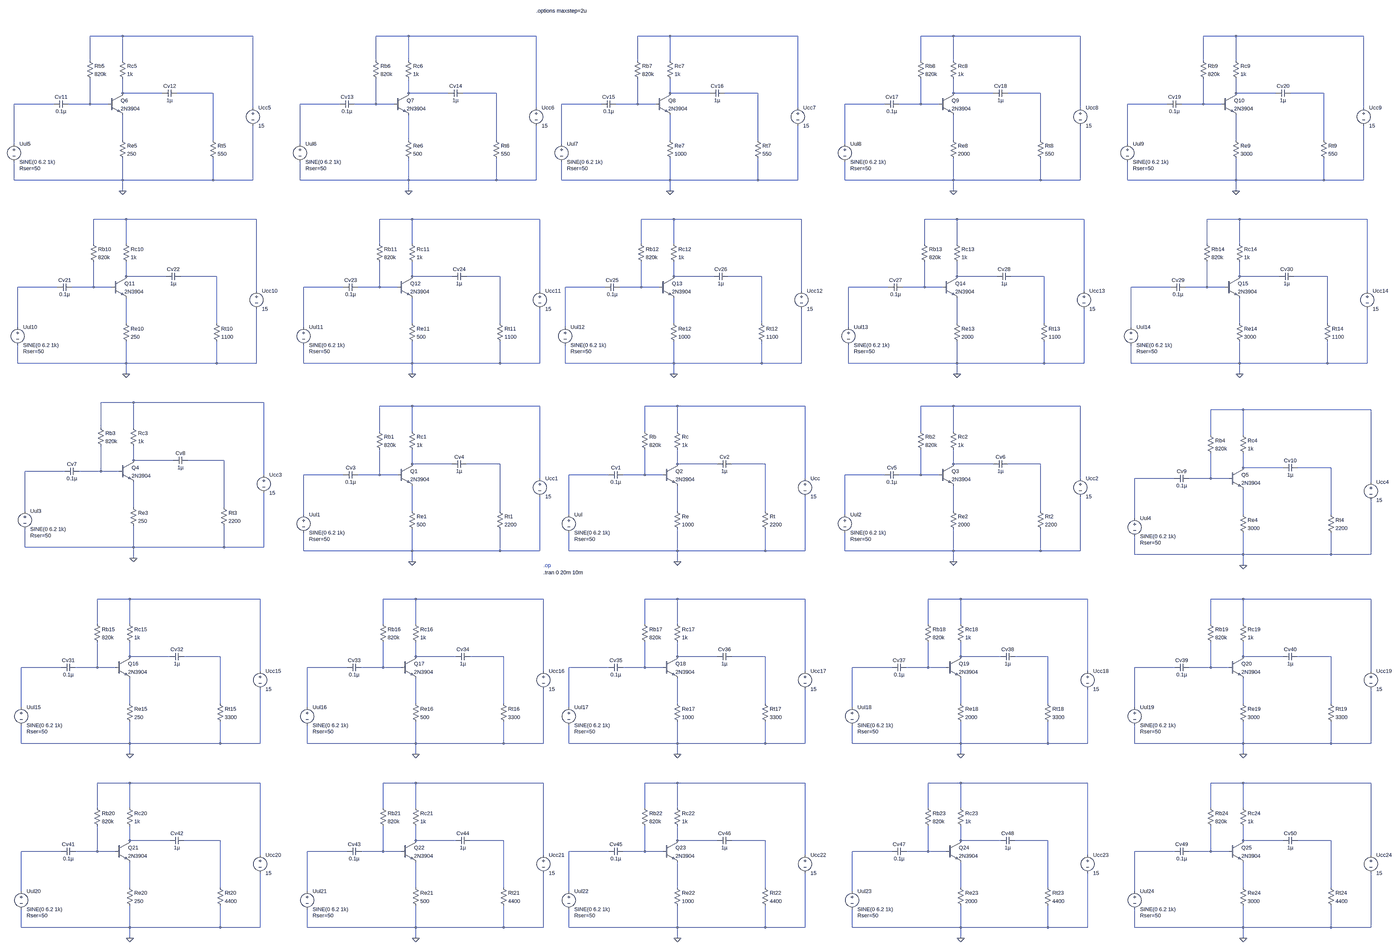
[diagram p0: schematic SPOJ-SZE-SIMULACIJA.asc, whole sheet]
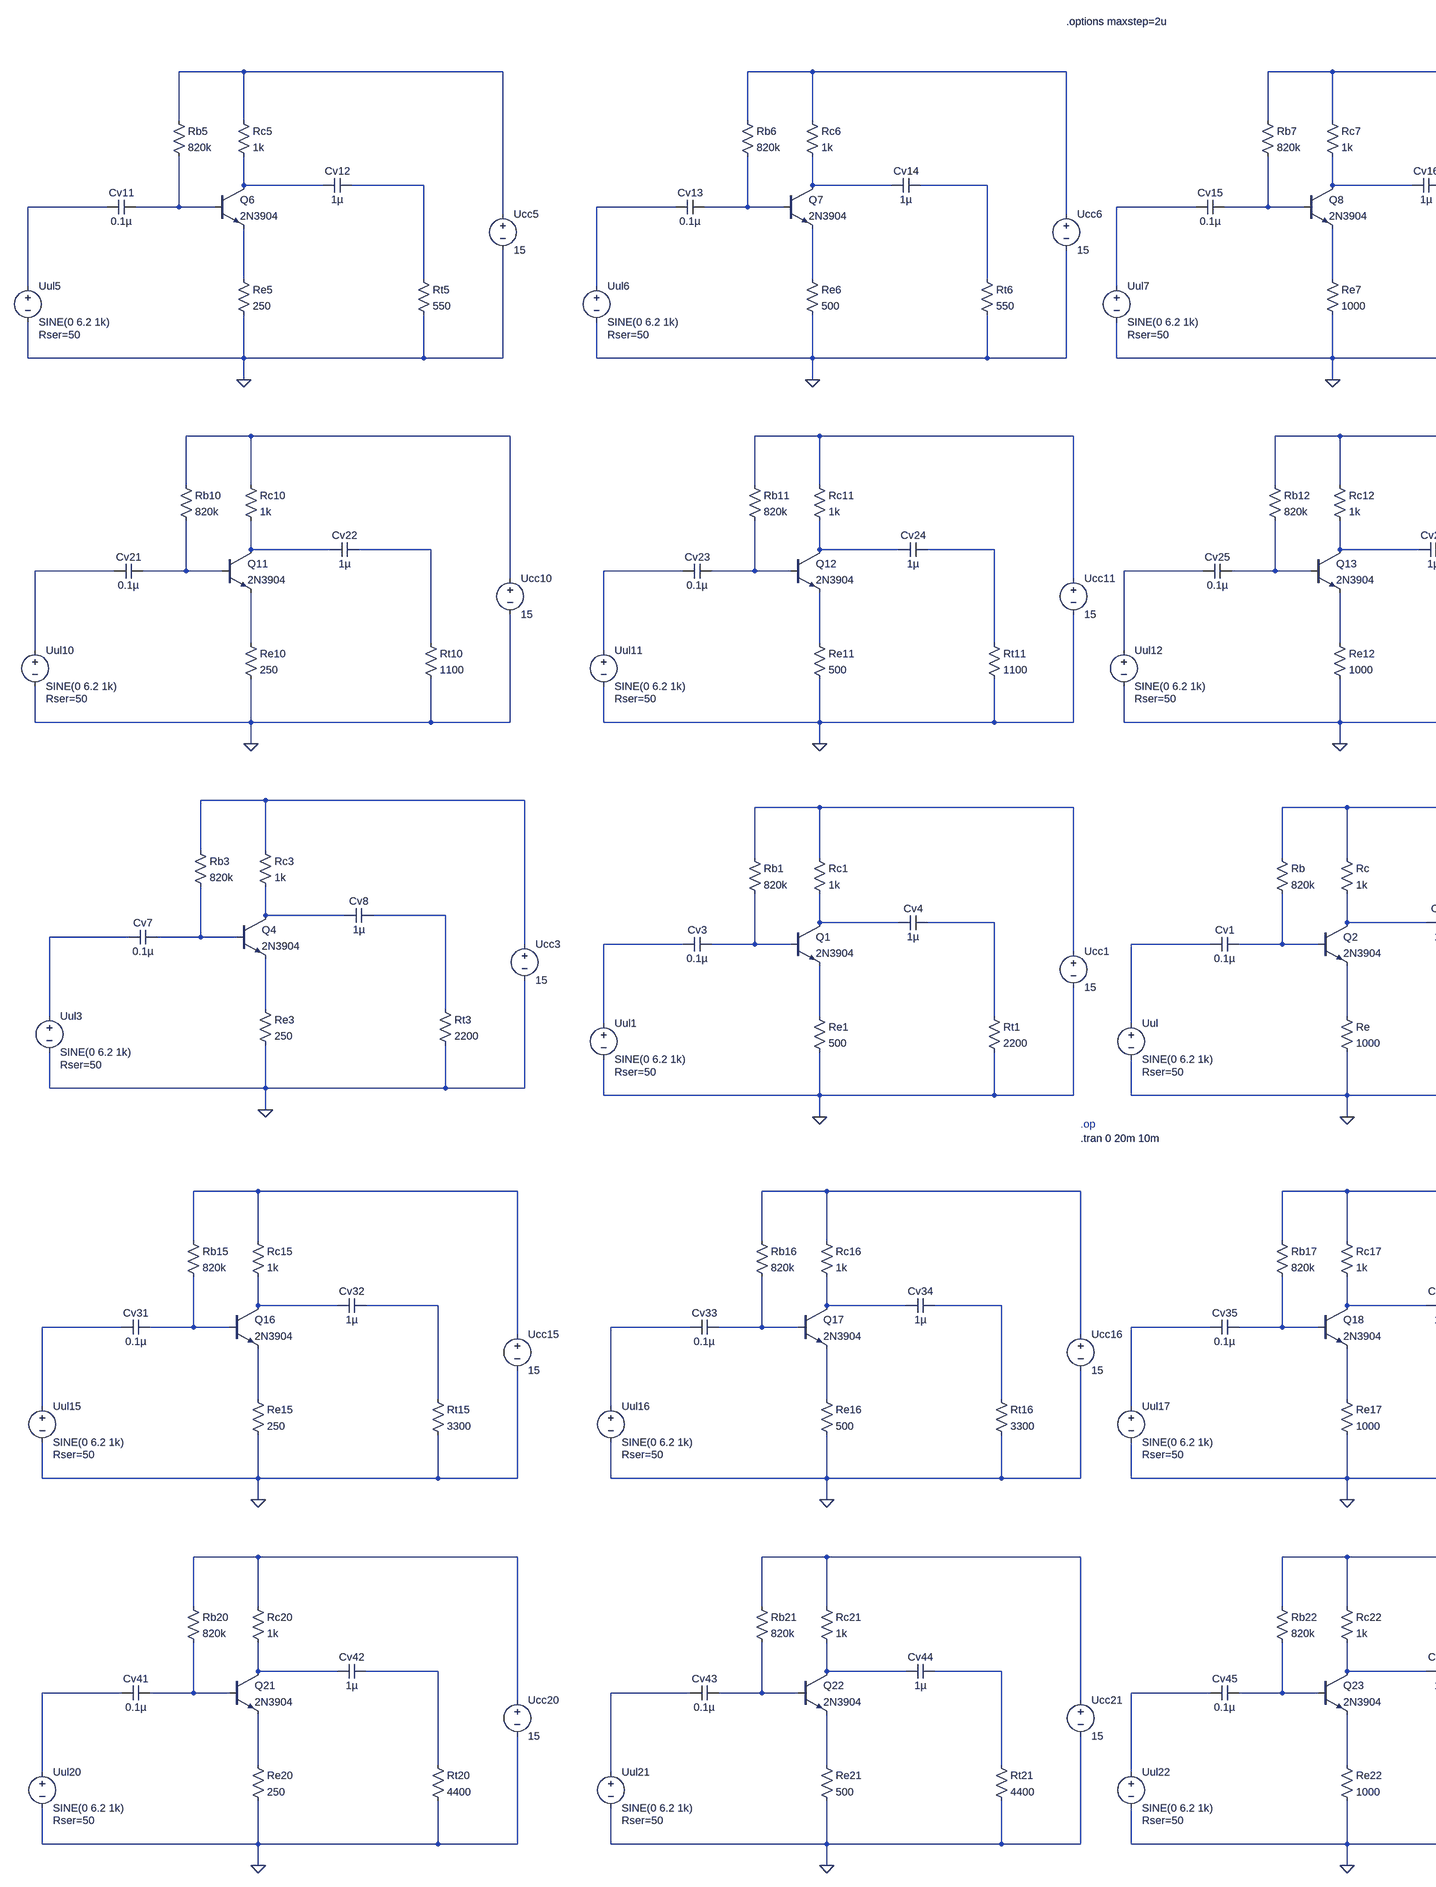
[diagram p1: schematic SPOJ-SZE-SIMULACIJA.asc, part, row 1 of 1, column 1 of 2]
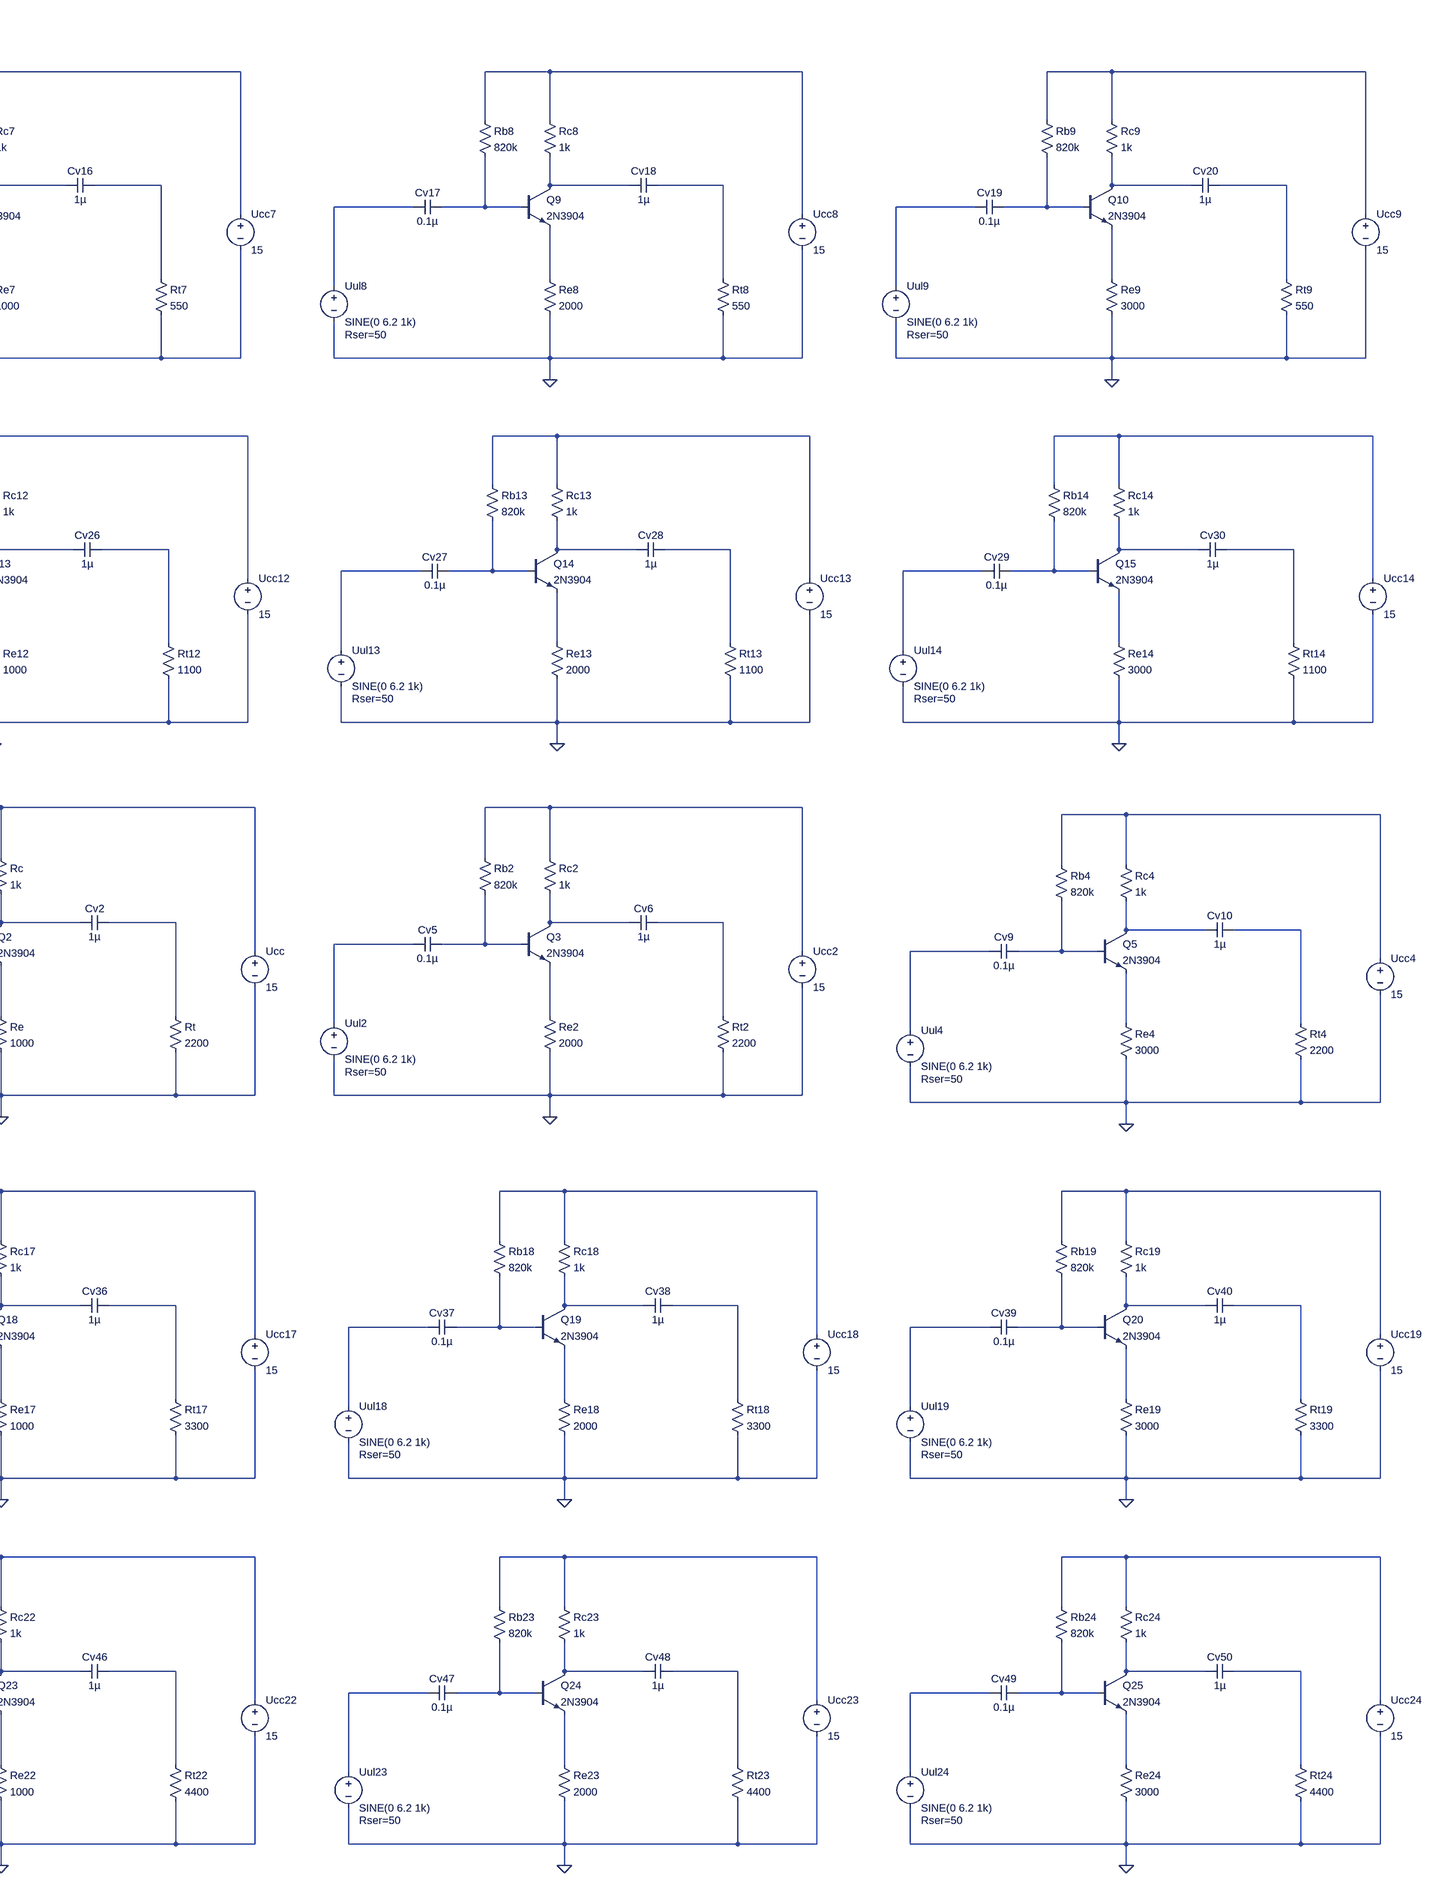
[diagram p2: schematic SPOJ-SZE-SIMULACIJA.asc, part, row 1 of 1, column 2 of 2]
SPOJ-SZE-SIMULACIJA.asc, the LTspice schematic file:
Version 4.1
SHEET 1 4308 3988
WIRE -1392 -464 -1536 -464
WIRE -816 -464 -1392 -464
WIRE -128 -464 -272 -464
WIRE 448 -464 -128 -464
WIRE 1040 -464 896 -464
WIRE 1616 -464 1040 -464
WIRE 2304 -464 2160 -464
WIRE 2880 -464 2304 -464
WIRE 3568 -464 3424 -464
WIRE 4144 -464 3568 -464
WIRE -1536 -352 -1536 -464
WIRE -1392 -352 -1392 -464
WIRE -272 -352 -272 -464
WIRE -128 -352 -128 -464
WIRE 896 -352 896 -464
WIRE 1040 -352 1040 -464
WIRE 2160 -352 2160 -464
WIRE 2304 -352 2304 -464
WIRE 3424 -352 3424 -464
WIRE 3568 -352 3568 -464
WIRE -1392 -208 -1392 -272
WIRE -1216 -208 -1392 -208
WIRE -992 -208 -1152 -208
WIRE -128 -208 -128 -272
WIRE 48 -208 -128 -208
WIRE 272 -208 112 -208
WIRE 1040 -208 1040 -272
WIRE 1216 -208 1040 -208
WIRE 1440 -208 1280 -208
WIRE 2304 -208 2304 -272
WIRE 2480 -208 2304 -208
WIRE 2704 -208 2544 -208
WIRE 3568 -208 3568 -272
WIRE 3744 -208 3568 -208
WIRE 3968 -208 3808 -208
WIRE -1696 -160 -1872 -160
WIRE -1536 -160 -1536 -272
WIRE -1536 -160 -1632 -160
WIRE -1456 -160 -1536 -160
WIRE -432 -160 -608 -160
WIRE -272 -160 -272 -272
WIRE -272 -160 -368 -160
WIRE -192 -160 -272 -160
WIRE 736 -160 560 -160
WIRE 896 -160 896 -272
WIRE 896 -160 800 -160
WIRE 976 -160 896 -160
WIRE 2000 -160 1824 -160
WIRE 2160 -160 2160 -272
WIRE 2160 -160 2064 -160
WIRE 2240 -160 2160 -160
WIRE 3264 -160 3088 -160
WIRE 3424 -160 3424 -272
WIRE 3424 -160 3328 -160
WIRE 3504 -160 3424 -160
WIRE -816 -144 -816 -464
WIRE 448 -144 448 -464
WIRE 1616 -144 1616 -464
WIRE 2880 -144 2880 -464
WIRE 4144 -144 4144 -464
WIRE -1392 0 -1392 -112
WIRE -992 0 -992 -208
WIRE -128 0 -128 -112
WIRE 272 0 272 -208
WIRE 1040 0 1040 -112
WIRE 1440 0 1440 -208
WIRE 2304 0 2304 -112
WIRE 2704 0 2704 -208
WIRE 3568 0 3568 -112
WIRE 3968 0 3968 -208
WIRE -1872 16 -1872 -160
WIRE -608 16 -608 -160
WIRE 560 16 560 -160
WIRE 1824 16 1824 -160
WIRE 3088 16 3088 -160
WIRE -1872 176 -1872 96
WIRE -1392 176 -1392 80
WIRE -1392 176 -1872 176
WIRE -992 176 -992 80
WIRE -992 176 -1392 176
WIRE -816 176 -816 -64
WIRE -816 176 -992 176
WIRE -608 176 -608 96
WIRE -128 176 -128 80
WIRE -128 176 -608 176
WIRE 272 176 272 80
WIRE 272 176 -128 176
WIRE 448 176 448 -64
WIRE 448 176 272 176
WIRE 560 176 560 96
WIRE 1040 176 1040 80
WIRE 1040 176 560 176
WIRE 1440 176 1440 80
WIRE 1440 176 1040 176
WIRE 1616 176 1616 -64
WIRE 1616 176 1440 176
WIRE 1824 176 1824 96
WIRE 2304 176 2304 80
WIRE 2304 176 1824 176
WIRE 2704 176 2704 80
WIRE 2704 176 2304 176
WIRE 2880 176 2880 -64
WIRE 2880 176 2704 176
WIRE 3088 176 3088 96
WIRE 3568 176 3568 80
WIRE 3568 176 3088 176
WIRE 3968 176 3968 80
WIRE 3968 176 3568 176
WIRE 4144 176 4144 -64
WIRE 4144 176 3968 176
WIRE -1392 224 -1392 176
WIRE -128 224 -128 176
WIRE 1040 224 1040 176
WIRE 2304 224 2304 176
WIRE 3568 224 3568 176
WIRE -1376 464 -1520 464
WIRE -800 464 -1376 464
WIRE -112 464 -256 464
WIRE 464 464 -112 464
WIRE 1056 464 912 464
WIRE 1632 464 1056 464
WIRE 2320 464 2176 464
WIRE 2896 464 2320 464
WIRE 3584 464 3440 464
WIRE 4160 464 3584 464
WIRE -1520 576 -1520 464
WIRE -1376 576 -1376 464
WIRE -256 576 -256 464
WIRE -112 576 -112 464
WIRE 912 576 912 464
WIRE 1056 576 1056 464
WIRE 2176 576 2176 464
WIRE 2320 576 2320 464
WIRE 3440 576 3440 464
WIRE 3584 576 3584 464
WIRE -1376 720 -1376 656
WIRE -1200 720 -1376 720
WIRE -976 720 -1136 720
WIRE -112 720 -112 656
WIRE 64 720 -112 720
WIRE 288 720 128 720
WIRE 1056 720 1056 656
WIRE 1232 720 1056 720
WIRE 1456 720 1296 720
WIRE 2320 720 2320 656
WIRE 2496 720 2320 720
WIRE 2720 720 2560 720
WIRE 3584 720 3584 656
WIRE 3760 720 3584 720
WIRE 3984 720 3824 720
WIRE -1680 768 -1856 768
WIRE -1520 768 -1520 656
WIRE -1520 768 -1616 768
WIRE -1440 768 -1520 768
WIRE -416 768 -592 768
WIRE -256 768 -256 656
WIRE -256 768 -352 768
WIRE -176 768 -256 768
WIRE 752 768 576 768
WIRE 912 768 912 656
WIRE 912 768 816 768
WIRE 992 768 912 768
WIRE 2016 768 1840 768
WIRE 2176 768 2176 656
WIRE 2176 768 2080 768
WIRE 2256 768 2176 768
WIRE 3280 768 3104 768
WIRE 3440 768 3440 656
WIRE 3440 768 3344 768
WIRE 3520 768 3440 768
WIRE -800 784 -800 464
WIRE 464 784 464 464
WIRE 1632 784 1632 464
WIRE 2896 784 2896 464
WIRE 4160 784 4160 464
WIRE -1376 928 -1376 816
WIRE -976 928 -976 720
WIRE -112 928 -112 816
WIRE 288 928 288 720
WIRE 1056 928 1056 816
WIRE 1456 928 1456 720
WIRE 2320 928 2320 816
WIRE 2720 928 2720 720
WIRE 3584 928 3584 816
WIRE 3984 928 3984 720
WIRE -1856 944 -1856 768
WIRE -592 944 -592 768
WIRE 576 944 576 768
WIRE 1840 944 1840 768
WIRE 3104 944 3104 768
WIRE -1856 1104 -1856 1024
WIRE -1376 1104 -1376 1008
WIRE -1376 1104 -1856 1104
WIRE -976 1104 -976 1008
WIRE -976 1104 -1376 1104
WIRE -800 1104 -800 864
WIRE -800 1104 -976 1104
WIRE -592 1104 -592 1024
WIRE -112 1104 -112 1008
WIRE -112 1104 -592 1104
WIRE 288 1104 288 1008
WIRE 288 1104 -112 1104
WIRE 464 1104 464 864
WIRE 464 1104 288 1104
WIRE 576 1104 576 1024
WIRE 1056 1104 1056 1008
WIRE 1056 1104 576 1104
WIRE 1456 1104 1456 1008
WIRE 1456 1104 1056 1104
WIRE 1632 1104 1632 864
WIRE 1632 1104 1456 1104
WIRE 1840 1104 1840 1024
WIRE 2320 1104 2320 1008
WIRE 2320 1104 1840 1104
WIRE 2720 1104 2720 1008
WIRE 2720 1104 2320 1104
WIRE 2896 1104 2896 864
WIRE 2896 1104 2720 1104
WIRE 3104 1104 3104 1024
WIRE 3584 1104 3584 1008
WIRE 3584 1104 3104 1104
WIRE 3984 1104 3984 1008
WIRE 3984 1104 3584 1104
WIRE 4160 1104 4160 864
WIRE 4160 1104 3984 1104
WIRE -1376 1152 -1376 1104
WIRE -112 1152 -112 1104
WIRE 1056 1152 1056 1104
WIRE 2320 1152 2320 1104
WIRE 3584 1152 3584 1104
WIRE -1344 1296 -1488 1296
WIRE -768 1296 -1344 1296
WIRE -112 1312 -256 1312
WIRE 464 1312 -112 1312
WIRE 1072 1312 928 1312
WIRE 1648 1312 1072 1312
WIRE 2304 1312 2160 1312
WIRE 2880 1312 2304 1312
WIRE 3600 1328 3456 1328
WIRE 4176 1328 3600 1328
WIRE -1488 1408 -1488 1296
WIRE -1344 1408 -1344 1296
WIRE -256 1424 -256 1312
WIRE -112 1424 -112 1312
WIRE 928 1424 928 1312
WIRE 1072 1424 1072 1312
WIRE 2160 1424 2160 1312
WIRE 2304 1424 2304 1312
WIRE 3456 1440 3456 1328
WIRE 3600 1440 3600 1328
WIRE -1344 1552 -1344 1488
WIRE -1168 1552 -1344 1552
WIRE -944 1552 -1104 1552
WIRE -112 1568 -112 1504
WIRE 64 1568 -112 1568
WIRE 288 1568 128 1568
WIRE 1072 1568 1072 1504
WIRE 1248 1568 1072 1568
WIRE 1472 1568 1312 1568
WIRE 2304 1568 2304 1504
WIRE 2480 1568 2304 1568
WIRE 2704 1568 2544 1568
WIRE 3600 1584 3600 1520
WIRE 3776 1584 3600 1584
WIRE 4000 1584 3840 1584
WIRE -1648 1600 -1824 1600
WIRE -1488 1600 -1488 1488
WIRE -1488 1600 -1584 1600
WIRE -1408 1600 -1488 1600
WIRE -768 1616 -768 1296
WIRE -416 1616 -592 1616
WIRE -256 1616 -256 1504
WIRE -256 1616 -352 1616
WIRE -176 1616 -256 1616
WIRE 768 1616 592 1616
WIRE 928 1616 928 1504
WIRE 928 1616 832 1616
WIRE 1008 1616 928 1616
WIRE 2000 1616 1824 1616
WIRE 2160 1616 2160 1504
WIRE 2160 1616 2064 1616
WIRE 2240 1616 2160 1616
WIRE 464 1632 464 1312
WIRE 1648 1632 1648 1312
WIRE 2880 1632 2880 1312
WIRE 3296 1632 3120 1632
WIRE 3456 1632 3456 1520
WIRE 3456 1632 3360 1632
WIRE 3536 1632 3456 1632
WIRE 4176 1648 4176 1328
WIRE -1344 1760 -1344 1648
WIRE -944 1760 -944 1552
WIRE -1824 1776 -1824 1600
WIRE -112 1776 -112 1664
WIRE 288 1776 288 1568
WIRE 1072 1776 1072 1664
WIRE 1472 1776 1472 1568
WIRE 2304 1776 2304 1664
WIRE 2704 1776 2704 1568
WIRE -592 1792 -592 1616
WIRE 592 1792 592 1616
WIRE 1824 1792 1824 1616
WIRE 3600 1792 3600 1680
WIRE 4000 1792 4000 1584
WIRE 3120 1808 3120 1632
WIRE -1824 1936 -1824 1856
WIRE -1344 1936 -1344 1840
WIRE -1344 1936 -1824 1936
WIRE -944 1936 -944 1840
WIRE -944 1936 -1344 1936
WIRE -768 1936 -768 1696
WIRE -768 1936 -944 1936
WIRE -592 1952 -592 1872
WIRE -112 1952 -112 1856
WIRE -112 1952 -592 1952
WIRE 288 1952 288 1856
WIRE 288 1952 -112 1952
WIRE 464 1952 464 1712
WIRE 464 1952 288 1952
WIRE 592 1952 592 1872
WIRE 1072 1952 1072 1856
WIRE 1072 1952 592 1952
WIRE 1472 1952 1472 1856
WIRE 1472 1952 1072 1952
WIRE 1648 1952 1648 1712
WIRE 1648 1952 1472 1952
WIRE 1824 1952 1824 1872
WIRE 2304 1952 2304 1856
WIRE 2304 1952 1824 1952
WIRE 2704 1952 2704 1856
WIRE 2704 1952 2304 1952
WIRE 2880 1952 2880 1712
WIRE 2880 1952 2704 1952
WIRE 3120 1968 3120 1888
WIRE 3600 1968 3600 1872
WIRE 3600 1968 3120 1968
WIRE 4000 1968 4000 1872
WIRE 4000 1968 3600 1968
WIRE 4176 1968 4176 1728
WIRE 4176 1968 4000 1968
WIRE -1344 1984 -1344 1936
WIRE -112 2000 -112 1952
WIRE 1072 2000 1072 1952
WIRE 2304 2000 2304 1952
WIRE 3600 2016 3600 1968
WIRE -1360 2320 -1504 2320
WIRE -784 2320 -1360 2320
WIRE -96 2320 -240 2320
WIRE 480 2320 -96 2320
WIRE 1072 2320 928 2320
WIRE 1648 2320 1072 2320
WIRE 2336 2320 2192 2320
WIRE 2912 2320 2336 2320
WIRE 3600 2320 3456 2320
WIRE 4176 2320 3600 2320
WIRE -1504 2432 -1504 2320
WIRE -1360 2432 -1360 2320
WIRE -240 2432 -240 2320
WIRE -96 2432 -96 2320
WIRE 928 2432 928 2320
WIRE 1072 2432 1072 2320
WIRE 2192 2432 2192 2320
WIRE 2336 2432 2336 2320
WIRE 3456 2432 3456 2320
WIRE 3600 2432 3600 2320
WIRE -1360 2576 -1360 2512
WIRE -1184 2576 -1360 2576
WIRE -960 2576 -1120 2576
WIRE -96 2576 -96 2512
WIRE 80 2576 -96 2576
WIRE 304 2576 144 2576
WIRE 1072 2576 1072 2512
WIRE 1248 2576 1072 2576
WIRE 1472 2576 1312 2576
WIRE 2336 2576 2336 2512
WIRE 2512 2576 2336 2576
WIRE 2736 2576 2576 2576
WIRE 3600 2576 3600 2512
WIRE 3776 2576 3600 2576
WIRE 4000 2576 3840 2576
WIRE -1664 2624 -1840 2624
WIRE -1504 2624 -1504 2512
WIRE -1504 2624 -1600 2624
WIRE -1424 2624 -1504 2624
WIRE -400 2624 -576 2624
WIRE -240 2624 -240 2512
WIRE -240 2624 -336 2624
WIRE -160 2624 -240 2624
WIRE 768 2624 592 2624
WIRE 928 2624 928 2512
WIRE 928 2624 832 2624
WIRE 1008 2624 928 2624
WIRE 2032 2624 1856 2624
WIRE 2192 2624 2192 2512
WIRE 2192 2624 2096 2624
WIRE 2272 2624 2192 2624
WIRE 3296 2624 3120 2624
WIRE 3456 2624 3456 2512
WIRE 3456 2624 3360 2624
WIRE 3536 2624 3456 2624
WIRE -784 2640 -784 2320
WIRE 480 2640 480 2320
WIRE 1648 2640 1648 2320
WIRE 2912 2640 2912 2320
WIRE 4176 2640 4176 2320
WIRE -1360 2784 -1360 2672
WIRE -960 2784 -960 2576
WIRE -96 2784 -96 2672
WIRE 304 2784 304 2576
WIRE 1072 2784 1072 2672
WIRE 1472 2784 1472 2576
WIRE 2336 2784 2336 2672
WIRE 2736 2784 2736 2576
WIRE 3600 2784 3600 2672
WIRE 4000 2784 4000 2576
WIRE -1840 2800 -1840 2624
WIRE -576 2800 -576 2624
WIRE 592 2800 592 2624
WIRE 1856 2800 1856 2624
WIRE 3120 2800 3120 2624
WIRE -1840 2960 -1840 2880
WIRE -1360 2960 -1360 2864
WIRE -1360 2960 -1840 2960
WIRE -960 2960 -960 2864
WIRE -960 2960 -1360 2960
WIRE -784 2960 -784 2720
WIRE -784 2960 -960 2960
WIRE -576 2960 -576 2880
WIRE -96 2960 -96 2864
WIRE -96 2960 -576 2960
WIRE 304 2960 304 2864
WIRE 304 2960 -96 2960
WIRE 480 2960 480 2720
WIRE 480 2960 304 2960
WIRE 592 2960 592 2880
WIRE 1072 2960 1072 2864
WIRE 1072 2960 592 2960
WIRE 1472 2960 1472 2864
WIRE 1472 2960 1072 2960
WIRE 1648 2960 1648 2720
WIRE 1648 2960 1472 2960
WIRE 1856 2960 1856 2880
WIRE 2336 2960 2336 2864
WIRE 2336 2960 1856 2960
WIRE 2736 2960 2736 2864
WIRE 2736 2960 2336 2960
WIRE 2912 2960 2912 2720
WIRE 2912 2960 2736 2960
WIRE 3120 2960 3120 2880
WIRE 3600 2960 3600 2864
WIRE 3600 2960 3120 2960
WIRE 4000 2960 4000 2864
WIRE 4000 2960 3600 2960
WIRE 4176 2960 4176 2720
WIRE 4176 2960 4000 2960
WIRE -1360 3008 -1360 2960
WIRE -96 3008 -96 2960
WIRE 1072 3008 1072 2960
WIRE 2336 3008 2336 2960
WIRE 3600 3008 3600 2960
WIRE -1360 3280 -1504 3280
WIRE -784 3280 -1360 3280
WIRE -96 3280 -240 3280
WIRE 480 3280 -96 3280
WIRE 1072 3280 928 3280
WIRE 1648 3280 1072 3280
WIRE 2336 3280 2192 3280
WIRE 2912 3280 2336 3280
WIRE 3600 3280 3456 3280
WIRE 4176 3280 3600 3280
WIRE -1504 3392 -1504 3280
WIRE -1360 3392 -1360 3280
WIRE -240 3392 -240 3280
WIRE -96 3392 -96 3280
WIRE 928 3392 928 3280
WIRE 1072 3392 1072 3280
WIRE 2192 3392 2192 3280
WIRE 2336 3392 2336 3280
WIRE 3456 3392 3456 3280
WIRE 3600 3392 3600 3280
WIRE -1360 3536 -1360 3472
WIRE -1184 3536 -1360 3536
WIRE -960 3536 -1120 3536
WIRE -96 3536 -96 3472
WIRE 80 3536 -96 3536
WIRE 304 3536 144 3536
WIRE 1072 3536 1072 3472
WIRE 1248 3536 1072 3536
WIRE 1472 3536 1312 3536
WIRE 2336 3536 2336 3472
WIRE 2512 3536 2336 3536
WIRE 2736 3536 2576 3536
WIRE 3600 3536 3600 3472
WIRE 3776 3536 3600 3536
WIRE 4000 3536 3840 3536
WIRE -1664 3584 -1840 3584
WIRE -1504 3584 -1504 3472
WIRE -1504 3584 -1600 3584
WIRE -1424 3584 -1504 3584
WIRE -400 3584 -576 3584
WIRE -240 3584 -240 3472
WIRE -240 3584 -336 3584
WIRE -160 3584 -240 3584
WIRE 768 3584 592 3584
WIRE 928 3584 928 3472
WIRE 928 3584 832 3584
WIRE 1008 3584 928 3584
WIRE 2032 3584 1856 3584
WIRE 2192 3584 2192 3472
WIRE 2192 3584 2096 3584
WIRE 2272 3584 2192 3584
WIRE 3296 3584 3120 3584
WIRE 3456 3584 3456 3472
WIRE 3456 3584 3360 3584
WIRE 3536 3584 3456 3584
WIRE -784 3600 -784 3280
WIRE 480 3600 480 3280
WIRE 1648 3600 1648 3280
WIRE 2912 3600 2912 3280
WIRE 4176 3600 4176 3280
WIRE -1360 3744 -1360 3632
WIRE -960 3744 -960 3536
WIRE -96 3744 -96 3632
WIRE 304 3744 304 3536
WIRE 1072 3744 1072 3632
WIRE 1472 3744 1472 3536
WIRE 2336 3744 2336 3632
WIRE 2736 3744 2736 3536
WIRE 3600 3744 3600 3632
WIRE 4000 3744 4000 3536
WIRE -1840 3760 -1840 3584
WIRE -576 3760 -576 3584
WIRE 592 3760 592 3584
WIRE 1856 3760 1856 3584
WIRE 3120 3760 3120 3584
WIRE -1840 3920 -1840 3840
WIRE -1360 3920 -1360 3824
WIRE -1360 3920 -1840 3920
WIRE -960 3920 -960 3824
WIRE -960 3920 -1360 3920
WIRE -784 3920 -784 3680
WIRE -784 3920 -960 3920
WIRE -576 3920 -576 3840
WIRE -96 3920 -96 3824
WIRE -96 3920 -576 3920
WIRE 304 3920 304 3824
WIRE 304 3920 -96 3920
WIRE 480 3920 480 3680
WIRE 480 3920 304 3920
WIRE 592 3920 592 3840
WIRE 1072 3920 1072 3824
WIRE 1072 3920 592 3920
WIRE 1472 3920 1472 3824
WIRE 1472 3920 1072 3920
WIRE 1648 3920 1648 3680
WIRE 1648 3920 1472 3920
WIRE 1856 3920 1856 3840
WIRE 2336 3920 2336 3824
WIRE 2336 3920 1856 3920
WIRE 2736 3920 2736 3824
WIRE 2736 3920 2336 3920
WIRE 2912 3920 2912 3680
WIRE 2912 3920 2736 3920
WIRE 3120 3920 3120 3840
WIRE 3600 3920 3600 3824
WIRE 3600 3920 3120 3920
WIRE 4000 3920 4000 3824
WIRE 4000 3920 3600 3920
WIRE 4176 3920 4176 3680
WIRE 4176 3920 4000 3920
WIRE -1360 3968 -1360 3920
WIRE -96 3968 -96 3920
WIRE 1072 3968 1072 3920
WIRE 2336 3968 2336 3920
WIRE 3600 3968 3600 3920
FLAG 1072 2000 0
FLAG -112 2000 0
FLAG 2304 2000 0
FLAG -1344 1984 0
FLAG 3600 2016 0
FLAG -1392 224 0
FLAG -128 224 0
FLAG 1040 224 0
FLAG 2304 224 0
FLAG 3568 224 0
FLAG -1376 1152 0
FLAG -112 1152 0
FLAG 1056 1152 0
FLAG 2320 1152 0
FLAG 3584 1152 0
FLAG -1360 3008 0
FLAG -96 3008 0
FLAG 1072 3008 0
FLAG 2336 3008 0
FLAG 3600 3008 0
FLAG -1360 3968 0
FLAG -96 3968 0
FLAG 1072 3968 0
FLAG 2336 3968 0
FLAG 3600 3968 0
SYMBOL npn 1008 1568 R0
SYMATTR InstName Q2
SYMATTR Value 2N3904
SYMBOL cap 832 1600 R90
WINDOW 0 0 32 VBottom 2
WINDOW 3 32 32 VTop 2
SYMATTR InstName Cv1
SYMATTR Value 0.1µ
SYMBOL cap 1312 1552 R90
WINDOW 0 0 32 VBottom 2
WINDOW 3 32 32 VTop 2
SYMATTR InstName Cv2
SYMATTR Value 1µ
SYMBOL res 1056 1760 R0
SYMATTR InstName Re
SYMATTR Value 1000
SYMBOL res 1456 1760 R0
SYMATTR InstName Rt
SYMATTR Value 2200
SYMBOL voltage 592 1776 R0
WINDOW 123 0 0 Left 0
WINDOW 39 24 124 Left 2
SYMATTR SpiceLine Rser=50
SYMATTR InstName Uul
SYMATTR Value SINE(0 6.2 1k)
SYMBOL voltage 1648 1616 R0
WINDOW 123 0 0 Left 0
WINDOW 39 0 0 Left 0
SYMATTR InstName Ucc
SYMATTR Value 15
SYMBOL res 1056 1408 R0
SYMATTR InstName Rc
SYMATTR Value 1k
SYMBOL res 912 1408 R0
SYMATTR InstName Rb
SYMATTR Value 820k
SYMBOL npn -176 1568 R0
SYMATTR InstName Q1
SYMATTR Value 2N3904
SYMBOL cap -352 1600 R90
WINDOW 0 0 32 VBottom 2
WINDOW 3 32 32 VTop 2
SYMATTR InstName Cv3
SYMATTR Value 0.1µ
SYMBOL cap 128 1552 R90
WINDOW 0 0 32 VBottom 2
WINDOW 3 32 32 VTop 2
SYMATTR InstName Cv4
SYMATTR Value 1µ
SYMBOL res -128 1760 R0
SYMATTR InstName Re1
SYMATTR Value 500
SYMBOL res 272 1760 R0
SYMATTR InstName Rt1
SYMATTR Value 2200
SYMBOL voltage -592 1776 R0
WINDOW 123 0 0 Left 0
WINDOW 39 24 124 Left 2
SYMATTR SpiceLine Rser=50
SYMATTR InstName Uul1
SYMATTR Value SINE(0 6.2 1k)
SYMBOL voltage 464 1616 R0
WINDOW 123 0 0 Left 0
WINDOW 39 0 0 Left 0
SYMATTR InstName Ucc1
SYMATTR Value 15
SYMBOL res -128 1408 R0
SYMATTR InstName Rc1
SYMATTR Value 1k
SYMBOL res -272 1408 R0
SYMATTR InstName Rb1
SYMATTR Value 820k
SYMBOL npn 2240 1568 R0
SYMATTR InstName Q3
SYMATTR Value 2N3904
SYMBOL cap 2064 1600 R90
WINDOW 0 0 32 VBottom 2
WINDOW 3 32 32 VTop 2
SYMATTR InstName Cv5
SYMATTR Value 0.1µ
SYMBOL cap 2544 1552 R90
WINDOW 0 0 32 VBottom 2
WINDOW 3 32 32 VTop 2
SYMATTR InstName Cv6
SYMATTR Value 1µ
SYMBOL res 2288 1760 R0
SYMATTR InstName Re2
SYMATTR Value 2000
SYMBOL res 2688 1760 R0
SYMATTR InstName Rt2
SYMATTR Value 2200
SYMBOL voltage 1824 1776 R0
WINDOW 123 0 0 Left 0
WINDOW 39 24 124 Left 2
SYMATTR SpiceLine Rser=50
SYMATTR InstName Uul2
SYMATTR Value SINE(0 6.2 1k)
SYMBOL voltage 2880 1616 R0
WINDOW 123 0 0 Left 0
WINDOW 39 0 0 Left 0
SYMATTR InstName Ucc2
SYMATTR Value 15
SYMBOL res 2288 1408 R0
SYMATTR InstName Rc2
SYMATTR Value 1k
SYMBOL res 2144 1408 R0
SYMATTR InstName Rb2
SYMATTR Value 820k
SYMBOL npn -1408 1552 R0
SYMATTR InstName Q4
SYMATTR Value 2N3904
SYMBOL cap -1584 1584 R90
WINDOW 0 0 32 VBottom 2
WINDOW 3 32 32 VTop 2
SYMATTR InstName Cv7
SYMATTR Value 0.1µ
SYMBOL cap -1104 1536 R90
WINDOW 0 0 32 VBottom 2
WINDOW 3 32 32 VTop 2
SYMATTR InstName Cv8
SYMATTR Value 1µ
SYMBOL res -1360 1744 R0
SYMATTR InstName Re3
SYMATTR Value 250
SYMBOL res -960 1744 R0
SYMATTR InstName Rt3
SYMATTR Value 2200
SYMBOL voltage -1824 1760 R0
WINDOW 123 0 0 Left 0
WINDOW 39 24 124 Left 2
SYMATTR SpiceLine Rser=50
SYMATTR InstName Uul3
SYMATTR Value SINE(0 6.2 1k)
SYMBOL voltage -768 1600 R0
WINDOW 123 0 0 Left 0
WINDOW 39 0 0 Left 0
SYMATTR InstName Ucc3
SYMATTR Value 15
SYMBOL res -1360 1392 R0
SYMATTR InstName Rc3
SYMATTR Value 1k
SYMBOL res -1504 1392 R0
SYMATTR InstName Rb3
SYMATTR Value 820k
SYMBOL npn 3536 1584 R0
SYMATTR InstName Q5
SYMATTR Value 2N3904
SYMBOL cap 3360 1616 R90
WINDOW 0 0 32 VBottom 2
WINDOW 3 32 32 VTop 2
SYMATTR InstName Cv9
SYMATTR Value 0.1µ
SYMBOL cap 3840 1568 R90
WINDOW 0 0 32 VBottom 2
WINDOW 3 32 32 VTop 2
SYMATTR InstName Cv10
SYMATTR Value 1µ
SYMBOL res 3584 1776 R0
SYMATTR InstName Re4
SYMATTR Value 3000
SYMBOL res 3984 1776 R0
SYMATTR InstName Rt4
SYMATTR Value 2200
SYMBOL voltage 3120 1792 R0
WINDOW 123 0 0 Left 0
WINDOW 39 24 124 Left 2
SYMATTR SpiceLine Rser=50
SYMATTR InstName Uul4
SYMATTR Value SINE(0 6.2 1k)
SYMBOL voltage 4176 1632 R0
WINDOW 123 0 0 Left 0
WINDOW 39 0 0 Left 0
SYMATTR InstName Ucc4
SYMATTR Value 15
SYMBOL res 3584 1424 R0
SYMATTR InstName Rc4
SYMATTR Value 1k
SYMBOL res 3440 1424 R0
SYMATTR InstName Rb4
SYMATTR Value 820k
SYMBOL npn -1456 -208 R0
SYMATTR InstName Q6
SYMATTR Value 2N3904
SYMBOL cap -1632 -176 R90
WINDOW 0 0 32 VBottom 2
WINDOW 3 32 32 VTop 2
SYMATTR InstName Cv11
SYMATTR Value 0.1µ
SYMBOL cap -1152 -224 R90
WINDOW 0 0 32 VBottom 2
WINDOW 3 32 32 VTop 2
SYMATTR InstName Cv12
SYMATTR Value 1µ
SYMBOL res -1408 -16 R0
SYMATTR InstName Re5
SYMATTR Value 250
SYMBOL res -1008 -16 R0
SYMATTR InstName Rt5
SYMATTR Value 550
SYMBOL voltage -1872 0 R0
WINDOW 123 0 0 Left 0
WINDOW 39 24 124 Left 2
SYMATTR SpiceLine Rser=50
SYMATTR InstName Uul5
SYMATTR Value SINE(0 6.2 1k)
SYMBOL voltage -816 -160 R0
WINDOW 123 0 0 Left 0
WINDOW 39 0 0 Left 0
SYMATTR InstName Ucc5
SYMATTR Value 15
SYMBOL res -1408 -368 R0
SYMATTR InstName Rc5
SYMATTR Value 1k
SYMBOL res -1552 -368 R0
SYMATTR InstName Rb5
SYMATTR Value 820k
SYMBOL npn -192 -208 R0
SYMATTR InstName Q7
SYMATTR Value 2N3904
SYMBOL cap -368 -176 R90
WINDOW 0 0 32 VBottom 2
WINDOW 3 32 32 VTop 2
SYMATTR InstName Cv13
SYMATTR Value 0.1µ
SYMBOL cap 112 -224 R90
WINDOW 0 0 32 VBottom 2
WINDOW 3 32 32 VTop 2
SYMATTR InstName Cv14
SYMATTR Value 1µ
SYMBOL res -144 -16 R0
SYMATTR InstName Re6
SYMATTR Value 500
SYMBOL res 256 -16 R0
SYMATTR InstName Rt6
SYMATTR Value 550
SYMBOL voltage -608 0 R0
WINDOW 123 0 0 Left 0
WINDOW 39 24 124 Left 2
SYMATTR SpiceLine Rser=50
SYMATTR InstName Uul6
SYMATTR Value SINE(0 6.2 1k)
SYMBOL voltage 448 -160 R0
WINDOW 123 0 0 Left 0
WINDOW 39 0 0 Left 0
SYMATTR InstName Ucc6
SYMATTR Value 15
SYMBOL res -144 -368 R0
SYMATTR InstName Rc6
SYMATTR Value 1k
SYMBOL res -288 -368 R0
SYMATTR InstName Rb6
SYMATTR Value 820k
SYMBOL npn 976 -208 R0
SYMATTR InstName Q8
SYMATTR Value 2N3904
SYMBOL cap 800 -176 R90
WINDOW 0 0 32 VBottom 2
WINDOW 3 32 32 VTop 2
SYMATTR InstName Cv15
SYMATTR Value 0.1µ
SYMBOL cap 1280 -224 R90
WINDOW 0 0 32 VBottom 2
WINDOW 3 32 32 VTop 2
SYMATTR InstName Cv16
SYMATTR Value 1µ
SYMBOL res 1024 -16 R0
SYMATTR InstName Re7
SYMATTR Value 1000
SYMBOL res 1424 -16 R0
SYMATTR InstName Rt7
SYMATTR Value 550
SYMBOL voltage 560 0 R0
WINDOW 123 0 0 Left 0
WINDOW 39 24 124 Left 2
SYMATTR SpiceLine Rser=50
SYMATTR InstName Uul7
SYMATTR Value SINE(0 6.2 1k)
SYMBOL voltage 1616 -160 R0
WINDOW 123 0 0 Left 0
WINDOW 39 0 0 Left 0
SYMATTR InstName Ucc7
SYMATTR Value 15
SYMBOL res 1024 -368 R0
SYMATTR InstName Rc7
SYMATTR Value 1k
SYMBOL res 880 -368 R0
SYMATTR InstName Rb7
SYMATTR Value 820k
SYMBOL npn 2240 -208 R0
SYMATTR InstName Q9
SYMATTR Value 2N3904
SYMBOL cap 2064 -176 R90
WINDOW 0 0 32 VBottom 2
WINDOW 3 32 32 VTop 2
SYMATTR InstName Cv17
SYMATTR Value 0.1µ
SYMBOL cap 2544 -224 R90
WINDOW 0 0 32 VBottom 2
WINDOW 3 32 32 VTop 2
SYMATTR InstName Cv18
SYMATTR Value 1µ
SYMBOL res 2288 -16 R0
SYMATTR InstName Re8
SYMATTR Value 2000
SYMBOL res 2688 -16 R0
SYMATTR InstName Rt8
SYMATTR Value 550
SYMBOL voltage 1824 0 R0
WINDOW 123 0 0 Left 0
WINDOW 39 24 124 Left 2
SYMATTR SpiceLine Rser=50
SYMATTR InstName Uul8
SYMATTR Value SINE(0 6.2 1k)
SYMBOL voltage 2880 -160 R0
WINDOW 123 0 0 Left 0
WINDOW 39 0 0 Left 0
SYMATTR InstName Ucc8
SYMATTR Value 15
SYMBOL res 2288 -368 R0
SYMATTR InstName Rc8
SYMATTR Value 1k
SYMBOL res 2144 -368 R0
SYMATTR InstName Rb8
SYMATTR Value 820k
SYMBOL npn 3504 -208 R0
SYMATTR InstName Q10
SYMATTR Value 2N3904
SYMBOL cap 3328 -176 R90
WINDOW 0 0 32 VBottom 2
WINDOW 3 32 32 VTop 2
SYMATTR InstName Cv19
SYMATTR Value 0.1µ
SYMBOL cap 3808 -224 R90
WINDOW 0 0 32 VBottom 2
WINDOW 3 32 32 VTop 2
SYMATTR InstName Cv20
SYMATTR Value 1µ
SYMBOL res 3552 -16 R0
SYMATTR InstName Re9
SYMATTR Value 3000
SYMBOL res 3952 -16 R0
SYMATTR InstName Rt9
SYMATTR Value 550
SYMBOL voltage 3088 0 R0
WINDOW 123 0 0 Left 0
WINDOW 39 24 124 Left 2
SYMATTR SpiceLine Rser=50
SYMATTR InstName Uul9
SYMATTR Value SINE(0 6.2 1k)
SYMBOL voltage 4144 -160 R0
WINDOW 123 0 0 Left 0
WINDOW 39 0 0 Left 0
SYMATTR InstName Ucc9
SYMATTR Value 15
SYMBOL res 3552 -368 R0
SYMATTR InstName Rc9
SYMATTR Value 1k
SYMBOL res 3408 -368 R0
SYMATTR InstName Rb9
SYMATTR Value 820k
SYMBOL npn -1440 720 R0
SYMATTR InstName Q11
SYMATTR Value 2N3904
SYMBOL cap -1616 752 R90
WINDOW 0 0 32 VBottom 2
WINDOW 3 32 32 VTop 2
SYMATTR InstName Cv21
SYMATTR Value 0.1µ
SYMBOL cap -1136 704 R90
WINDOW 0 0 32 VBottom 2
WINDOW 3 32 32 VTop 2
SYMATTR InstName Cv22
SYMATTR Value 1µ
SYMBOL res -1392 912 R0
SYMATTR InstName Re10
SYMATTR Value 250
SYMBOL res -992 912 R0
SYMATTR InstName Rt10
SYMATTR Value 1100
SYMBOL voltage -1856 928 R0
WINDOW 123 0 0 Left 0
WINDOW 39 24 124 Left 2
SYMATTR SpiceLine Rser=50
SYMATTR InstName Uul10
SYMATTR Value SINE(0 6.2 1k)
SYMBOL voltage -800 768 R0
WINDOW 123 0 0 Left 0
WINDOW 39 0 0 Left 0
SYMATTR InstName Ucc10
SYMATTR Value 15
SYMBOL res -1392 560 R0
SYMATTR InstName Rc10
SYMATTR Value 1k
SYMBOL res -1536 560 R0
SYMATTR InstName Rb10
SYMATTR Value 820k
SYMBOL npn -176 720 R0
SYMATTR InstName Q12
SYMATTR Value 2N3904
SYMBOL cap -352 752 R90
WINDOW 0 0 32 VBottom 2
WINDOW 3 32 32 VTop 2
SYMATTR InstName Cv23
SYMATTR Value 0.1µ
SYMBOL cap 128 704 R90
WINDOW 0 0 32 VBottom 2
WINDOW 3 32 32 VTop 2
SYMATTR InstName Cv24
SYMATTR Value 1µ
SYMBOL res -128 912 R0
SYMATTR InstName Re11
SYMATTR Value 500
SYMBOL res 272 912 R0
SYMATTR InstName Rt11
SYMATTR Value 1100
SYMBOL voltage -592 928 R0
WINDOW 123 0 0 Left 0
WINDOW 39 24 124 Left 2
SYMATTR SpiceLine Rser=50
SYMATTR InstName Uul11
SYMATTR Value SINE(0 6.2 1k)
SYMBOL voltage 464 768 R0
WINDOW 123 0 0 Left 0
WINDOW 39 0 0 Left 0
SYMATTR InstName Ucc11
SYMATTR Value 15
SYMBOL res -128 560 R0
SYMATTR InstName Rc11
SYMATTR Value 1k
SYMBOL res -272 560 R0
SYMATTR InstName Rb11
SYMATTR Value 820k
SYMBOL npn 992 720 R0
SYMATTR InstName Q13
SYMATTR Value 2N3904
SYMBOL cap 816 752 R90
WINDOW 0 0 32 VBottom 2
WINDOW 3 32 32 VTop 2
SYMATTR InstName Cv25
SYMATTR Value 0.1µ
SYMBOL cap 1296 704 R90
WINDOW 0 0 32 VBottom 2
WINDOW 3 32 32 VTop 2
SYMATTR InstName Cv26
SYMATTR Value 1µ
SYMBOL res 1040 912 R0
SYMATTR InstName Re12
SYMATTR Value 1000
SYMBOL res 1440 912 R0
SYMATTR InstName Rt12
SYMATTR Value 1100
SYMBOL voltage 576 928 R0
WINDOW 123 0 0 Left 0
WINDOW 39 24 124 Left 2
SYMATTR SpiceLine Rser=50
SYMATTR InstName Uul12
SYMATTR Value SINE(0 6.2 1k)
SYMBOL voltage 1632 768 R0
WINDOW 123 0 0 Left 0
WINDOW 39 0 0 Left 0
SYMATTR InstName Ucc12
SYMATTR Value 15
SYMBOL res 1040 560 R0
SYMATTR InstName Rc12
SYMATTR Value 1k
SYMBOL res 896 560 R0
SYMATTR InstName Rb12
SYMATTR Value 820k
SYMBOL npn 2256 720 R0
SYMATTR InstName Q14
SYMATTR Value 2N3904
SYMBOL cap 2080 752 R90
WINDOW 0 0 32 VBottom 2
WINDOW 3 32 32 VTop 2
SYMATTR InstName Cv27
SYMATTR Value 0.1µ
SYMBOL cap 2560 704 R90
WINDOW 0 0 32 VBottom 2
WINDOW 3 32 32 VTop 2
SYMATTR InstName Cv28
SYMATTR Value 1µ
SYMBOL res 2304 912 R0
SYMATTR InstName Re13
SYMATTR Value 2000
SYMBOL res 2704 912 R0
SYMATTR InstName Rt13
SYMATTR Value 1100
SYMBOL voltage 1840 928 R0
WINDOW 123 0 0 Left 0
WINDOW 39 24 124 Left 2
SYMATTR SpiceLine Rser=50
SYMATTR InstName Uul13
SYMATTR Value SINE(0 6.2 1k)
SYMBOL voltage 2896 768 R0
WINDOW 123 0 0 Left 0
WINDOW 39 0 0 Left 0
SYMATTR InstName Ucc13
SYMATTR Value 15
SYMBOL res 2304 560 R0
SYMATTR InstName Rc13
SYMATTR Value 1k
SYMBOL res 2160 560 R0
SYMATTR InstName Rb13
SYMATTR Value 820k
SYMBOL npn 3520 720 R0
SYMATTR InstName Q15
SYMATTR Value 2N3904
SYMBOL cap 3344 752 R90
WINDOW 0 0 32 VBottom 2
WINDOW 3 32 32 VTop 2
SYMATTR InstName Cv29
SYMATTR Value 0.1µ
SYMBOL cap 3824 704 R90
WINDOW 0 0 32 VBottom 2
WINDOW 3 32 32 VTop 2
SYMATTR InstName Cv30
SYMATTR Value 1µ
SYMBOL res 3568 912 R0
SYMATTR InstName Re14
SYMATTR Value 3000
SYMBOL res 3968 912 R0
SYMATTR InstName Rt14
SYMATTR Value 1100
SYMBOL voltage 3104 928 R0
WINDOW 123 0 0 Left 0
WINDOW 39 24 124 Left 2
SYMATTR SpiceLine Rser=50
SYMATTR InstName Uul14
SYMATTR Value SINE(0 6.2 1k)
SYMBOL voltage 4160 768 R0
WINDOW 123 0 0 Left 0
WINDOW 39 0 0 Left 0
SYMATTR InstName Ucc14
SYMATTR Value 15
SYMBOL res 3568 560 R0
SYMATTR InstName Rc14
SYMATTR Value 1k
SYMBOL res 3424 560 R0
SYMATTR InstName Rb14
SYMATTR Value 820k
SYMBOL npn -1424 2576 R0
SYMATTR InstName Q16
SYMATTR Value 2N3904
SYMBOL cap -1600 2608 R90
WINDOW 0 0 32 VBottom 2
WINDOW 3 32 32 VTop 2
SYMATTR InstName Cv31
SYMATTR Value 0.1µ
SYMBOL cap -1120 2560 R90
WINDOW 0 0 32 VBottom 2
WINDOW 3 32 32 VTop 2
SYMATTR InstName Cv32
SYMATTR Value 1µ
SYMBOL res -1376 2768 R0
SYMATTR InstName Re15
SYMATTR Value 250
SYMBOL res -976 2768 R0
SYMATTR InstName Rt15
SYMATTR Value 3300
SYMBOL voltage -1840 2784 R0
WINDOW 123 0 0 Left 0
WINDOW 39 24 124 Left 2
SYMATTR SpiceLine Rser=50
SYMATTR InstName Uul15
SYMATTR Value SINE(0 6.2 1k)
SYMBOL voltage -784 2624 R0
WINDOW 123 0 0 Left 0
WINDOW 39 0 0 Left 0
SYMATTR InstName Ucc15
SYMATTR Value 15
SYMBOL res -1376 2416 R0
SYMATTR InstName Rc15
SYMATTR Value 1k
SYMBOL res -1520 2416 R0
SYMATTR InstName Rb15
SYMATTR Value 820k
SYMBOL npn -160 2576 R0
SYMATTR InstName Q17
SYMATTR Value 2N3904
SYMBOL cap -336 2608 R90
WINDOW 0 0 32 VBottom 2
WINDOW 3 32 32 VTop 2
SYMATTR InstName Cv33
SYMATTR Value 0.1µ
SYMBOL cap 144 2560 R90
WINDOW 0 0 32 VBottom 2
WINDOW 3 32 32 VTop 2
SYMATTR InstName Cv34
SYMATTR Value 1µ
SYMBOL res -112 2768 R0
SYMATTR InstName Re16
SYMATTR Value 500
SYMBOL res 288 2768 R0
SYMATTR InstName Rt16
SYMATTR Value 3300
SYMBOL voltage -576 2784 R0
WINDOW 123 0 0 Left 0
WINDOW 39 24 124 Left 2
SYMATTR SpiceLine Rser=50
SYMATTR InstName Uul16
SYMATTR Value SINE(0 6.2 1k)
SYMBOL voltage 480 2624 R0
WINDOW 123 0 0 Left 0
WINDOW 39 0 0 Left 0
SYMATTR InstName Ucc16
SYMATTR Value 15
SYMBOL res -112 2416 R0
SYMATTR InstName Rc16
SYMATTR Value 1k
SYMBOL res -256 2416 R0
SYMATTR InstName Rb16
SYMATTR Value 820k
SYMBOL npn 1008 2576 R0
SYMATTR InstName Q18
SYMATTR Value 2N3904
SYMBOL cap 832 2608 R90
WINDOW 0 0 32 VBottom 2
WINDOW 3 32 32 VTop 2
SYMATTR InstName Cv35
SYMATTR Value 0.1µ
SYMBOL cap 1312 2560 R90
WINDOW 0 0 32 VBottom 2
WINDOW 3 32 32 VTop 2
SYMATTR InstName Cv36
SYMATTR Value 1µ
SYMBOL res 1056 2768 R0
SYMATTR InstName Re17
SYMATTR Value 1000
SYMBOL res 1456 2768 R0
SYMATTR InstName Rt17
SYMATTR Value 3300
SYMBOL voltage 592 2784 R0
WINDOW 123 0 0 Left 0
WINDOW 39 24 124 Left 2
SYMATTR SpiceLine Rser=50
SYMATTR InstName Uul17
SYMATTR Value SINE(0 6.2 1k)
SYMBOL voltage 1648 2624 R0
WINDOW 123 0 0 Left 0
WINDOW 39 0 0 Left 0
SYMATTR InstName Ucc17
SYMATTR Value 15
SYMBOL res 1056 2416 R0
SYMATTR InstName Rc17
SYMATTR Value 1k
SYMBOL res 912 2416 R0
SYMATTR InstName Rb17
SYMATTR Value 820k
SYMBOL npn 2272 2576 R0
SYMATTR InstName Q19
SYMATTR Value 2N3904
SYMBOL cap 2096 2608 R90
WINDOW 0 0 32 VBottom 2
WINDOW 3 32 32 VTop 2
SYMATTR InstName Cv37
SYMATTR Value 0.1µ
SYMBOL cap 2576 2560 R90
WINDOW 0 0 32 VBottom 2
WINDOW 3 32 32 VTop 2
SYMATTR InstName Cv38
SYMATTR Value 1µ
SYMBOL res 2320 2768 R0
SYMATTR InstName Re18
SYMATTR Value 2000
SYMBOL res 2720 2768 R0
SYMATTR InstName Rt18
SYMATTR Value 3300
SYMBOL voltage 1856 2784 R0
WINDOW 123 0 0 Left 0
WINDOW 39 24 124 Left 2
SYMATTR SpiceLine Rser=50
SYMATTR InstName Uul18
SYMATTR Value SINE(0 6.2 1k)
SYMBOL voltage 2912 2624 R0
WINDOW 123 0 0 Left 0
WINDOW 39 0 0 Left 0
SYMATTR InstName Ucc18
SYMATTR Value 15
SYMBOL res 2320 2416 R0
SYMATTR InstName Rc18
SYMATTR Value 1k
SYMBOL res 2176 2416 R0
SYMATTR InstName Rb18
SYMATTR Value 820k
SYMBOL npn 3536 2576 R0
SYMATTR InstName Q20
SYMATTR Value 2N3904
SYMBOL cap 3360 2608 R90
WINDOW 0 0 32 VBottom 2
WINDOW 3 32 32 VTop 2
SYMATTR InstName Cv39
SYMATTR Value 0.1µ
SYMBOL cap 3840 2560 R90
WINDOW 0 0 32 VBottom 2
WINDOW 3 32 32 VTop 2
SYMATTR InstName Cv40
SYMATTR Value 1µ
SYMBOL res 3584 2768 R0
SYMATTR InstName Re19
SYMATTR Value 3000
SYMBOL res 3984 2768 R0
SYMATTR InstName Rt19
SYMATTR Value 3300
SYMBOL voltage 3120 2784 R0
WINDOW 123 0 0 Left 0
WINDOW 39 24 124 Left 2
SYMATTR SpiceLine Rser=50
SYMATTR InstName Uul19
SYMATTR Value SINE(0 6.2 1k)
SYMBOL voltage 4176 2624 R0
WINDOW 123 0 0 Left 0
WINDOW 39 0 0 Left 0
SYMATTR InstName Ucc19
SYMATTR Value 15
SYMBOL res 3584 2416 R0
SYMATTR InstName Rc19
SYMATTR Value 1k
SYMBOL res 3440 2416 R0
SYMATTR InstName Rb19
SYMATTR Value 820k
SYMBOL npn -1424 3536 R0
SYMATTR InstName Q21
SYMATTR Value 2N3904
SYMBOL cap -1600 3568 R90
WINDOW 0 0 32 VBottom 2
WINDOW 3 32 32 VTop 2
SYMATTR InstName Cv41
SYMATTR Value 0.1µ
SYMBOL cap -1120 3520 R90
WINDOW 0 0 32 VBottom 2
WINDOW 3 32 32 VTop 2
SYMATTR InstName Cv42
SYMATTR Value 1µ
SYMBOL res -1376 3728 R0
SYMATTR InstName Re20
SYMATTR Value 250
SYMBOL res -976 3728 R0
SYMATTR InstName Rt20
SYMATTR Value 4400
SYMBOL voltage -1840 3744 R0
WINDOW 123 0 0 Left 0
WINDOW 39 24 124 Left 2
SYMATTR SpiceLine Rser=50
SYMATTR InstName Uul20
SYMATTR Value SINE(0 6.2 1k)
SYMBOL voltage -784 3584 R0
WINDOW 123 0 0 Left 0
WINDOW 39 0 0 Left 0
SYMATTR InstName Ucc20
SYMATTR Value 15
SYMBOL res -1376 3376 R0
SYMATTR InstName Rc20
SYMATTR Value 1k
SYMBOL res -1520 3376 R0
SYMATTR InstName Rb20
SYMATTR Value 820k
SYMBOL npn -160 3536 R0
SYMATTR InstName Q22
SYMATTR Value 2N3904
SYMBOL cap -336 3568 R90
WINDOW 0 0 32 VBottom 2
WINDOW 3 32 32 VTop 2
SYMATTR InstName Cv43
SYMATTR Value 0.1µ
SYMBOL cap 144 3520 R90
WINDOW 0 0 32 VBottom 2
WINDOW 3 32 32 VTop 2
SYMATTR InstName Cv44
SYMATTR Value 1µ
SYMBOL res -112 3728 R0
SYMATTR InstName Re21
SYMATTR Value 500
SYMBOL res 288 3728 R0
SYMATTR InstName Rt21
SYMATTR Value 4400
SYMBOL voltage -576 3744 R0
WINDOW 123 0 0 Left 0
WINDOW 39 24 124 Left 2
SYMATTR SpiceLine Rser=50
SYMATTR InstName Uul21
SYMATTR Value SINE(0 6.2 1k)
SYMBOL voltage 480 3584 R0
WINDOW 123 0 0 Left 0
WINDOW 39 0 0 Left 0
SYMATTR InstName Ucc21
SYMATTR Value 15
SYMBOL res -112 3376 R0
SYMATTR InstName Rc21
SYMATTR Value 1k
SYMBOL res -256 3376 R0
SYMATTR InstName Rb21
SYMATTR Value 820k
SYMBOL npn 1008 3536 R0
SYMATTR InstName Q23
SYMATTR Value 2N3904
SYMBOL cap 832 3568 R90
WINDOW 0 0 32 VBottom 2
WINDOW 3 32 32 VTop 2
SYMATTR InstName Cv45
SYMATTR Value 0.1µ
SYMBOL cap 1312 3520 R90
WINDOW 0 0 32 VBottom 2
WINDOW 3 32 32 VTop 2
SYMATTR InstName Cv46
SYMATTR Value 1µ
SYMBOL res 1056 3728 R0
SYMATTR InstName Re22
SYMATTR Value 1000
SYMBOL res 1456 3728 R0
SYMATTR InstName Rt22
SYMATTR Value 4400
SYMBOL voltage 592 3744 R0
WINDOW 123 0 0 Left 0
WINDOW 39 24 124 Left 2
SYMATTR SpiceLine Rser=50
SYMATTR InstName Uul22
SYMATTR Value SINE(0 6.2 1k)
SYMBOL voltage 1648 3584 R0
WINDOW 123 0 0 Left 0
WINDOW 39 0 0 Left 0
SYMATTR InstName Ucc22
SYMATTR Value 15
SYMBOL res 1056 3376 R0
SYMATTR InstName Rc22
SYMATTR Value 1k
SYMBOL res 912 3376 R0
SYMATTR InstName Rb22
SYMATTR Value 820k
SYMBOL npn 2272 3536 R0
SYMATTR InstName Q24
SYMATTR Value 2N3904
SYMBOL cap 2096 3568 R90
WINDOW 0 0 32 VBottom 2
WINDOW 3 32 32 VTop 2
SYMATTR InstName Cv47
SYMATTR Value 0.1µ
SYMBOL cap 2576 3520 R90
WINDOW 0 0 32 VBottom 2
WINDOW 3 32 32 VTop 2
SYMATTR InstName Cv48
SYMATTR Value 1µ
SYMBOL res 2320 3728 R0
SYMATTR InstName Re23
SYMATTR Value 2000
SYMBOL res 2720 3728 R0
SYMATTR InstName Rt23
SYMATTR Value 4400
SYMBOL voltage 1856 3744 R0
WINDOW 123 0 0 Left 0
WINDOW 39 24 124 Left 2
SYMATTR SpiceLine Rser=50
SYMATTR InstName Uul23
SYMATTR Value SINE(0 6.2 1k)
SYMBOL voltage 2912 3584 R0
WINDOW 123 0 0 Left 0
WINDOW 39 0 0 Left 0
SYMATTR InstName Ucc23
SYMATTR Value 15
SYMBOL res 2320 3376 R0
SYMATTR InstName Rc23
SYMATTR Value 1k
SYMBOL res 2176 3376 R0
SYMATTR InstName Rb23
SYMATTR Value 820k
SYMBOL npn 3536 3536 R0
SYMATTR InstName Q25
SYMATTR Value 2N3904
SYMBOL cap 3360 3568 R90
WINDOW 0 0 32 VBottom 2
WINDOW 3 32 32 VTop 2
SYMATTR InstName Cv49
SYMATTR Value 0.1µ
SYMBOL cap 3840 3520 R90
WINDOW 0 0 32 VBottom 2
WINDOW 3 32 32 VTop 2
SYMATTR InstName Cv50
SYMATTR Value 1µ
SYMBOL res 3584 3728 R0
SYMATTR InstName Re24
SYMATTR Value 3000
SYMBOL res 3984 3728 R0
SYMATTR InstName Rt24
SYMATTR Value 4400
SYMBOL voltage 3120 3744 R0
WINDOW 123 0 0 Left 0
WINDOW 39 24 124 Left 2
SYMATTR SpiceLine Rser=50
SYMATTR InstName Uul24
SYMATTR Value SINE(0 6.2 1k)
SYMBOL voltage 4176 3584 R0
WINDOW 123 0 0 Left 0
WINDOW 39 0 0 Left 0
SYMATTR InstName Ucc24
SYMATTR Value 15
SYMBOL res 3584 3376 R0
SYMATTR InstName Rc24
SYMATTR Value 1k
SYMBOL res 3440 3376 R0
SYMATTR InstName Rb24
SYMATTR Value 820k
TEXT 480 2016 Left 2 ;.op
TEXT 480 2048 Left 2 !.tran 0 20m 10m
TEXT 448 -576 Left 2 !.options maxstep=2u

The netlist it stands for:
* SPOJ-SZE-SIMULACIJA.asc
Q2 N070 N081 N088 0 2N3904
Cv1 N081 N080 0.1µ
Cv2 N071 N070 1µ
Re N088 0 1000
Rt N071 0 2200
V§Uul N080 0 SINE(0 6.2 1k) Rser=50
V§Ucc N063 0 15
Rc N063 N070 1k
Rb N063 N081 820k
Q1 N068 N079 N087 0 2N3904
Cv3 N079 N078 0.1µ
Cv4 N069 N068 1µ
Re1 N087 0 500
Rt1 N069 0 2200
V§Uul1 N078 0 SINE(0 6.2 1k) Rser=50
V§Ucc1 N062 0 15
Rc1 N062 N068 1k
Rb1 N062 N079 820k
Q3 N072 N083 N089 0 2N3904
Cv5 N083 N082 0.1µ
Cv6 N073 N072 1µ
Re2 N089 0 2000
Rt2 N073 0 2200
V§Uul2 N082 0 SINE(0 6.2 1k) Rser=50
V§Ucc2 N064 0 15
Rc2 N064 N072 1k
Rb2 N064 N083 820k
Q4 N066 N077 N086 0 2N3904
Cv7 N077 N076 0.1µ
Cv8 N067 N066 1µ
Re3 N086 0 250
Rt3 N067 0 2200
V§Uul3 N076 0 SINE(0 6.2 1k) Rser=50
V§Ucc3 N061 0 15
Rc3 N061 N066 1k
Rb3 N061 N077 820k
Q5 N074 N085 N090 0 2N3904
Cv9 N085 N084 0.1µ
Cv10 N075 N074 1µ
Re4 N090 0 3000
Rt4 N075 0 2200
V§Uul4 N084 0 SINE(0 6.2 1k) Rser=50
V§Ucc4 N065 0 15
Rc4 N065 N074 1k
Rb4 N065 N085 820k
Q6 N006 N017 N026 0 2N3904
Cv11 N017 N016 0.1µ
Cv12 N007 N006 1µ
Re5 N026 0 250
Rt5 N007 0 550
V§Uul5 N016 0 SINE(0 6.2 1k) Rser=50
V§Ucc5 N001 0 15
Rc5 N001 N006 1k
Rb5 N001 N017 820k
Q7 N008 N019 N027 0 2N3904
Cv13 N019 N018 0.1µ
Cv14 N009 N008 1µ
Re6 N027 0 500
Rt6 N009 0 550
V§Uul6 N018 0 SINE(0 6.2 1k) Rser=50
V§Ucc6 N002 0 15
Rc6 N002 N008 1k
Rb6 N002 N019 820k
Q8 N010 N021 N028 0 2N3904
Cv15 N021 N020 0.1µ
Cv16 N011 N010 1µ
Re7 N028 0 1000
Rt7 N011 0 550
V§Uul7 N020 0 SINE(0 6.2 1k) Rser=50
V§Ucc7 N003 0 15
Rc7 N003 N010 1k
Rb7 N003 N021 820k
Q9 N012 N023 N029 0 2N3904
Cv17 N023 N022 0.1µ
Cv18 N013 N012 1µ
Re8 N029 0 2000
Rt8 N013 0 550
V§Uul8 N022 0 SINE(0 6.2 1k) Rser=50
V§Ucc8 N004 0 15
Rc8 N004 N012 1k
Rb8 N004 N023 820k
Q10 N014 N025 N030 0 2N3904
Cv19 N025 N024 0.1µ
Cv20 N015 N014 1µ
Re9 N030 0 3000
Rt9 N015 0 550
V§Uul9 N024 0 SINE(0 6.2 1k) Rser=50
V§Ucc9 N005 0 15
Rc9 N005 N014 1k
Rb9 N005 N025 820k
Q11 N036 N047 N056 0 2N3904
Cv21 N047 N046 0.1µ
Cv22 N037 N036 1µ
Re10 N056 0 250
Rt10 N037 0 1100
V§Uul10 N046 0 SINE(0 6.2 1k) Rser=50
V§Ucc10 N031 0 15
Rc10 N031 N036 1k
Rb10 N031 N047 820k
Q12 N038 N049 N057 0 2N3904
Cv23 N049 N048 0.1µ
Cv24 N039 N038 1µ
Re11 N057 0 500
Rt11 N039 0 1100
V§Uul11 N048 0 SINE(0 6.2 1k) Rser=50
V§Ucc11 N032 0 15
Rc11 N032 N038 1k
Rb11 N032 N049 820k
Q13 N040 N051 N058 0 2N3904
Cv25 N051 N050 0.1µ
Cv26 N041 N040 1µ
Re12 N058 0 1000
Rt12 N041 0 1100
V§Uul12 N050 0 SINE(0 6.2 1k) Rser=50
V§Ucc12 N033 0 15
Rc12 N033 N040 1k
Rb12 N033 N051 820k
Q14 N042 N053 N059 0 2N3904
Cv27 N053 N052 0.1µ
Cv28 N043 N042 1µ
Re13 N059 0 2000
Rt13 N043 0 1100
V§Uul13 N052 0 SINE(0 6.2 1k) Rser=50
V§Ucc13 N034 0 15
Rc13 N034 N042 1k
Rb13 N034 N053 820k
Q15 N044 N055 N060 0 2N3904
Cv29 N055 N054 0.1µ
Cv30 N045 N044 1µ
Re14 N060 0 3000
Rt14 N045 0 1100
V§Uul14 N054 0 SINE(0 6.2 1k) Rser=50
V§Ucc14 N035 0 15
Rc14 N035 N044 1k
Rb14 N035 N055 820k
Q16 N096 N107 N116 0 2N3904
Cv31 N107 N106 0.1µ
Cv32 N097 N096 1µ
Re15 N116 0 250
Rt15 N097 0 3300
V§Uul15 N106 0 SINE(0 6.2 1k) Rser=50
V§Ucc15 N091 0 15
Rc15 N091 N096 1k
Rb15 N091 N107 820k
Q17 N098 N109 N117 0 2N3904
Cv33 N109 N108 0.1µ
Cv34 N099 N098 1µ
Re16 N117 0 500
Rt16 N099 0 3300
V§Uul16 N108 0 SINE(0 6.2 1k) Rser=50
V§Ucc16 N092 0 15
Rc16 N092 N098 1k
Rb16 N092 N109 820k
Q18 N100 N111 N118 0 2N3904
Cv35 N111 N110 0.1µ
Cv36 N101 N100 1µ
Re17 N118 0 1000
Rt17 N101 0 3300
V§Uul17 N110 0 SINE(0 6.2 1k) Rser=50
V§Ucc17 N093 0 15
Rc17 N093 N100 1k
Rb17 N093 N111 820k
Q19 N102 N113 N119 0 2N3904
Cv37 N113 N112 0.1µ
Cv38 N103 N102 1µ
Re18 N119 0 2000
Rt18 N103 0 3300
V§Uul18 N112 0 SINE(0 6.2 1k) Rser=50
V§Ucc18 N094 0 15
Rc18 N094 N102 1k
Rb18 N094 N113 820k
Q20 N104 N115 N120 0 2N3904
Cv39 N115 N114 0.1µ
Cv40 N105 N104 1µ
Re19 N120 0 3000
Rt19 N105 0 3300
V§Uul19 N114 0 SINE(0 6.2 1k) Rser=50
V§Ucc19 N095 0 15
Rc19 N095 N104 1k
Rb19 N095 N115 820k
Q21 N126 N137 N146 0 2N3904
Cv41 N137 N136 0.1µ
Cv42 N127 N126 1µ
Re20 N146 0 250
Rt20 N127 0 4400
V§Uul20 N136 0 SINE(0 6.2 1k) Rser=50
V§Ucc20 N121 0 15
Rc20 N121 N126 1k
Rb20 N121 N137 820k
Q22 N128 N139 N147 0 2N3904
Cv43 N139 N138 0.1µ
Cv44 N129 N128 1µ
Re21 N147 0 500
Rt21 N129 0 4400
V§Uul21 N138 0 SINE(0 6.2 1k) Rser=50
V§Ucc21 N122 0 15
Rc21 N122 N128 1k
Rb21 N122 N139 820k
Q23 N130 N141 N148 0 2N3904
Cv45 N141 N140 0.1µ
Cv46 N131 N130 1µ
Re22 N148 0 1000
Rt22 N131 0 4400
V§Uul22 N140 0 SINE(0 6.2 1k) Rser=50
V§Ucc22 N123 0 15
Rc22 N123 N130 1k
Rb22 N123 N141 820k
Q24 N132 N143 N149 0 2N3904
Cv47 N143 N142 0.1µ
Cv48 N133 N132 1µ
Re23 N149 0 2000
Rt23 N133 0 4400
V§Uul23 N142 0 SINE(0 6.2 1k) Rser=50
V§Ucc23 N124 0 15
Rc23 N124 N132 1k
Rb23 N124 N143 820k
Q25 N134 N145 N150 0 2N3904
Cv49 N145 N144 0.1µ
Cv50 N135 N134 1µ
Re24 N150 0 3000
Rt24 N135 0 4400
V§Uul24 N144 0 SINE(0 6.2 1k) Rser=50
V§Ucc24 N125 0 15
Rc24 N125 N134 1k
Rb24 N125 N145 820k
.model NPN NPN
.model PNP PNP
.lib standard.bjt
* .op
.tran 0 20m 10m
.options maxstep=2u
.backanno
.end